# EAGLE schematic adc_led (EAGLE 9.5.2)
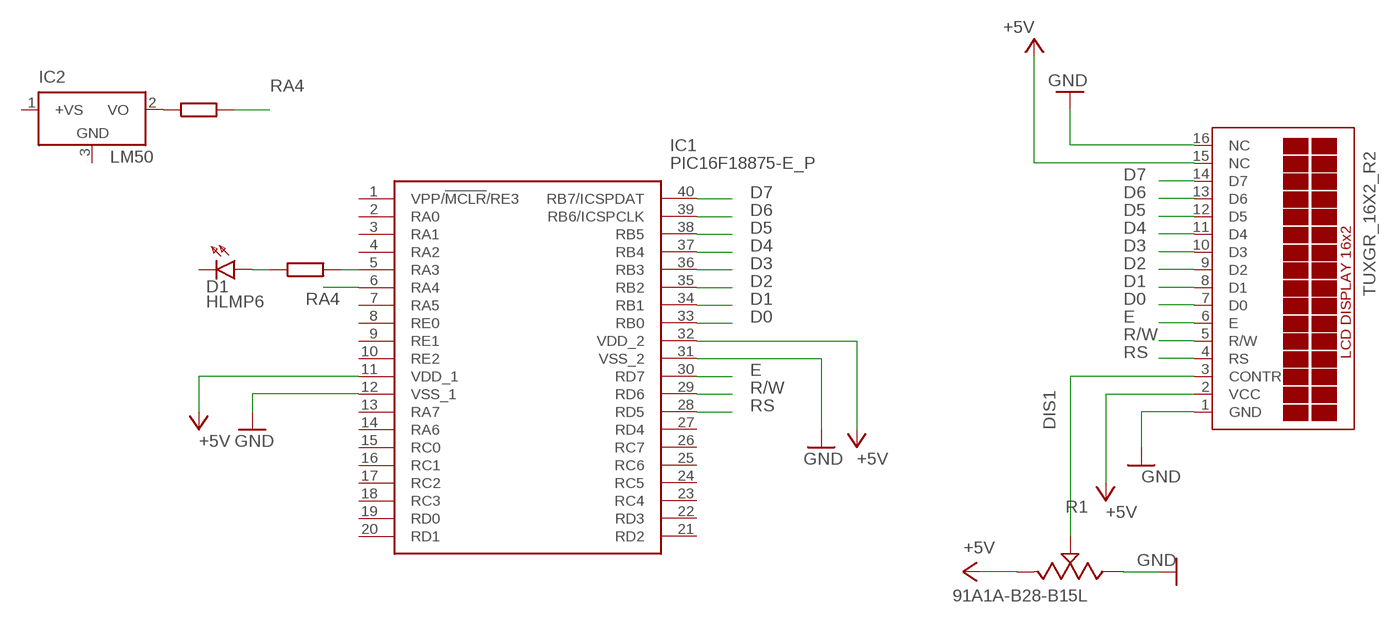
[diagram p0: schematic, sheet 1]

## Parts
D1  HLMP6  [HLMP6]
DIS1  TUXGR_16X2_R2  [TUXGR_16X2_R2]
IC1  PIC16F18875-E_P  [DIP1543W58P254L5175H635Q40N]
IC2  LM50  [SOT23]
R1  91A1A-B28-B15L  [91A1A-B28-B15L-ND]

## Nets
+5V: DIS1.2(VCC) DIS1.15(NC) IC1.11(VDD_1) IC1.32(VDD_2) R1.1
D0: DIS1.7(D0) IC1.33(RB0)
D1: DIS1.8(D1) IC1.34(RB1)
D2: DIS1.9(D2) IC1.35(RB2)
D3: DIS1.10(D3) IC1.36(RB3)
D4: DIS1.11(D4) IC1.37(RB4)
D5: DIS1.12(D5) IC1.38(RB5)
D6: DIS1.13(D6) IC1.39(RB6/ICSPCLK)
D7: DIS1.14(D7) IC1.40(RB7/ICSPDAT)
E: DIS1.6(E) IC1.30(RD7)
GND: DIS1.1(GND) DIS1.16(NC) IC1.12(VSS_1) IC1.31(VSS_2) R1.3
N$12: D1.A
N$13: IC1.5(RA3)
N$14: DIS1.3(CONTR) R1.2
R/W: DIS1.5(R/W) IC1.29(RD6)
RA4: IC1.6(RA4)
RS: DIS1.4(RS) IC1.28(RD5)
Unconnected: D1.K IC1.1(VPP/!MCLR!/RE3) IC1.2(RA0) IC1.3(RA1) IC1.4(RA2) IC1.7(RA5) IC1.8(RE0) IC1.9(RE1) IC1.10(RE2) IC1.13(RA7) IC1.14(RA6) IC1.15(RC0) IC1.16(RC1) IC1.17(RC2) IC1.18(RC3) IC1.19(RD0) IC1.20(RD1) IC1.21(RD2) IC1.22(RD3) IC1.23(RC4) IC1.24(RC5) IC1.25(RC6) IC1.26(RC7) IC1.27(RD4) IC2.1(+VS) IC2.2(VO)

## Power pins joined to a net without a drawn wire
GND: IC2.3(GND)

## Library data of the parts
D1 = display-hp:HLMP6: LED 2mm horizontal; MF: AGILENT TECHNOLOGIES; MPN: HLMP-6500; OC_FARNELL: 1652490; OC_NEWARK: 40K0088
DIS1 = display-lcd:TUXGR_16X2_R2: Tuxgraphics LCD display 16x2 characters reflective, without background light Source: tuxgr_12x2_r2.pdf; OC_FARNELL: unknown; OC_NEWARK: unknown
IC1 = PIC16F18875-E_P:PIC16F18875-E_P: 8-bit Microcontrollers - MCU 8-Bit MCU 14KB Flash 1KB RAM 256B EE CIP Source: Datasheet <http://www.mouser.com/datasheet/2/268/PIC16(L)F18855_75 Data Sheet_DS40001802E-1314217.pdf>; DESCRIPTION: 8-bit Microcontrollers - MCU 8-Bit MCU 14KB Flash 1KB RAM 256B EE CIP; HEIGHT: 6.35mm; MANUFACTURER_NAME: Microchip; MANUFACTURER_PART_NUMBER: PIC16F18875-E/P; MOUSER_PART_NUMBER: 579-PIC16F18875-E/P; MOUSER_PRICE-STOCK: https://www.mouser.com/Search/Refine.aspx?Keyword=579-PIC16F18875-E%2FP
IC2 = linear:LM50: SOT-23 Single-Supply Centigrade Temperature Sensor Vout = (10mV/°C x Temp °C) +5mmmV Source: http://cache.national.com/ds/LM/LM50.pdf
R1 = Potentiometer_Trimmers:91A1A-B28-B15L: POT 10K OHM 1W PLASTIC LINEAR Manufacturer's datasheet <https://www.bourns.com/docs/Product-Datasheets/91_95.pdf>; CREATED_BY: PCBLayout.com; DIGIKEY_PARTNO: 91A1A-B28-B15L-ND; MANUFACTURER: Bourns Inc.; MPN: 91A1A-B28-B15L